# Altium schematic sheet besc mcu sch.SchDoc
size A4
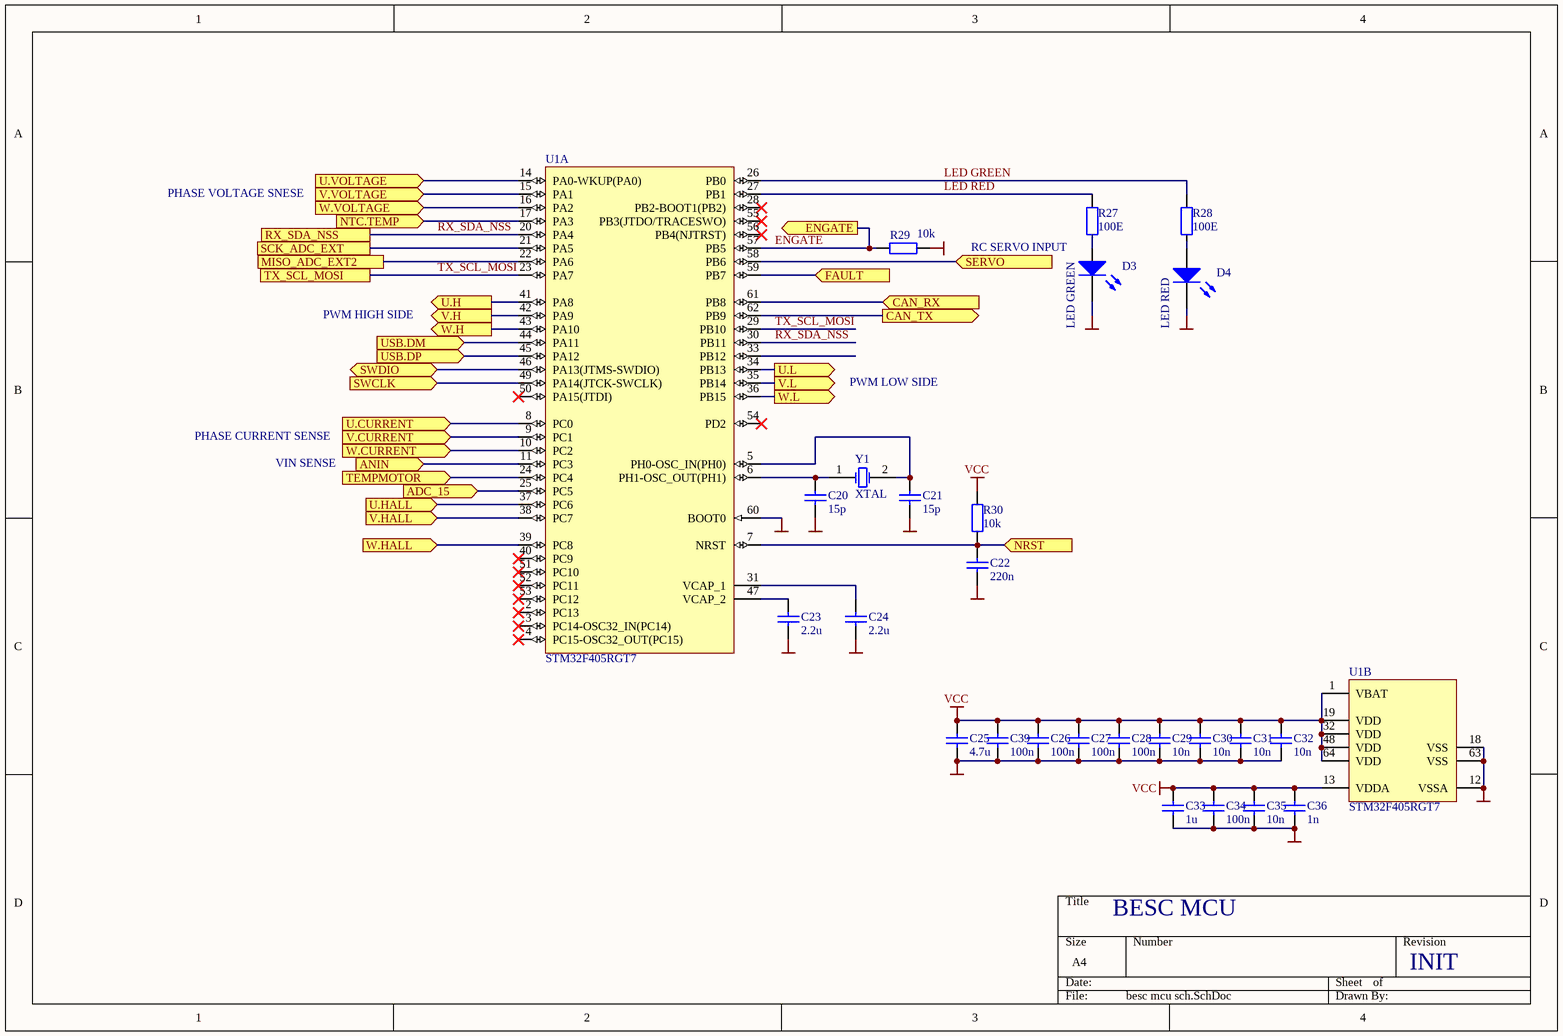
[diagram p0: besc mcu sch.SchDoc]

## Parts
C20  15p  [0603]
C21  15p  [0603]
C22  220n  [0603]
C23  2.2u  [0603]
C24  2.2u  [0603]
C25  4.7u  [0603]
C26  100n  [0603]
C27  100n  [0603]
C28  100n  [0603]
C29  10n  [0603]
C30  10n  [0603]
C31  10n  [0603]
C32  10n  [0603]
C33  1u  [0603]
C34  100n  [0603]
C35  10n  [0603]
C36  1n  [0603]
C39  100n  [0603]
D3  LED GREEN  [0805-diode]
D4  LED RED  [0805-diode]
R27  100E  [0603]
R28  100E  [0603]
R29  10k  [0603]
R30  10k  [0603]
U1  STM32F405RGT7  [STM-LQFP64_N]  (parts A,B of 2)
Y1  XTAL  [XTAL 5 x 3.2 mm]

## Ports
ADC_15 (in), ANIN (in), CAN_RX (in), CAN_TX (out), ENGATE (out), FAULT (in), MISO_ADC_EXT2, NRST (in), NTC.TEMP (in), RX_SDA_NSS, SCK_ADC_EXT, SERVO (in), SWCLK (in), SWDIO (bidir), TEMPMOTOR (in), TX_SCL_MOSI, U.CURRENT (in), U.H (out), U.HALL (in), U.L (out), U.VOLTAGE (in), USB.DM (in), USB.DP (in), V.CURRENT (in), V.H (out), V.HALL (in), V.L (out), V.VOLTAGE (in), W.CURRENT (in), W.H (out), W.HALL (in), W.L (out), W.VOLTAGE (in)

## Nets
LGND: C20.1 C21.1 C22.1 C23.1 C24.1 C25.1 C26.1 C27.1 C28.1 C29.1 C30.1 C31.1 C32.1 C33.1 C34.1 C35.1 C36.1 C39.1 D3.2(K) D4.2(K) R29.2 U1.12(VSSA) U1.18(VSS) U1.60(BOOT0) U1.63(VSS)
VCC: C25.2 C26.2 C27.2 C28.2 C29.2 C30.2 C31.2 C32.2 C33.2 C34.2 C35.2 C36.2 C39.2 R30.1 U1.1(VBAT) U1.13(VDDA) U1.19(VDD) U1.32(VDD) U1.48(VDD) U1.64(VDD)
ADC_15: U1.25(PC5) ; port ADC_15
ANIN: U1.11(PC3) ; port ANIN
CAN_RX: U1.61(PB8) ; port CAN_RX
CAN_TX: U1.62(PB9) ; port CAN_TX
ENGATE: R29.1 U1.57(PB5) ; port ENGATE
FAULT: U1.59(PB7) ; port FAULT
LED GREEN: R28.1 U1.26(PB0)
LED RED: R27.1 U1.27(PB1)
MISO_ADC_EXT2: U1.22(PA6) ; port MISO_ADC_EXT2
NRST: C22.2 R30.2 U1.7(NRST) ; port NRST
NTC.TEMP: U1.17(PA3) ; port NTC.TEMP
RX_SDA_NSS: U1.20(PA4) U1.30(PB11) ; port RX_SDA_NSS
SCK_ADC_EXT: U1.21(PA5) ; port SCK_ADC_EXT
SERVO: U1.58(PB6) ; port SERVO
SWCLK: U1.49(PA14(JTCK-SWCLK)) ; port SWCLK
SWDIO: U1.46(PA13(JTMS-SWDIO)) ; port SWDIO
TEMPMOTOR: U1.24(PC4) ; port TEMPMOTOR
TX_SCL_MOSI: U1.23(PA7) U1.29(PB10) ; port TX_SCL_MOSI
U.CURRENT: U1.8(PC0) ; port U.CURRENT
U.H: U1.41(PA8) ; port U.H
U.HALL: U1.37(PC6) ; port U.HALL
U.L: U1.34(PB13) ; port U.L
U.VOLTAGE: U1.14(PA0-WKUP(PA0)) ; port U.VOLTAGE
USB.DM: U1.44(PA11) ; port USB.DM
USB.DP: U1.45(PA12) ; port USB.DP
V.CURRENT: U1.9(PC1) ; port V.CURRENT
V.H: U1.42(PA9) ; port V.H
V.HALL: U1.38(PC7) ; port V.HALL
V.L: U1.35(PB14) ; port V.L
V.VOLTAGE: U1.15(PA1) ; port V.VOLTAGE
W.CURRENT: U1.10(PC2) ; port W.CURRENT
W.H: U1.43(PA10) ; port W.H
W.HALL: U1.39(PC8) ; port W.HALL
W.L: U1.36(PB15) ; port W.L
W.VOLTAGE: U1.16(PA2) ; port W.VOLTAGE
NetC20_2: C20.2 U1.6(PH1-OSC_OUT(PH1)) Y1.1(OSC1)
NetC21_2: C21.2 U1.5(PH0-OSC_IN(PH0)) Y1.2(OSC2)
NetC23_2: C23.2 U1.47(VCAP_2)
NetC24_2: C24.2 U1.31(VCAP_1)
NetD3_1: D3.1(A) R27.2
NetD4_1: D4.1(A) R28.2

Not connected (* = marked no-connect by the designer): U1 2(PC13)* 3(PC14-OSC32_IN(PC14))* 4(PC15-OSC32_OUT(PC15))* 28(PB2-BOOT1(PB2))* 33(PB12) 40(PC9)* 50(PA15(JTDI))* 51(PC10)* 52(PC11)* 53(PC12)* 54(PD2)* 55(PB3(JTDO/TRACESWO))* 56(PB4(NJTRST))*

## Notes on the sheet
- PHASE VOLTAGE SNESE
- RC SERVO INPUT
- PWM HIGH SIDE
- PWM LOW SIDE
- PHASE CURRENT SENSE
- VIN SENSE
- BESC MCU
- INIT

## Library data of the parts
C20-C36 C39 = cap: Capacitor; Published: 8-Jun-2000; LatestRevisionDate: 17-Jul-2002; LatestRevisionNote: Re-released for DXP Platform.; PackageReference: RAD-0.3; Publisher: Altium Limited; PackageDescription: Radial Cap, Thru-Hole; 2 Leads; 0.3 in Pin Spacing
D3 D4 = LED0: Typical INFRARED GaAs LED; Published: 8-Jun-2000; LatestRevisionDate: 08-Jul-2005; LatestRevisionNote: Mech Layer 1 removed.; PackageReference: LED-0; Publisher: Altium Limited; PackageDescription: LED; 2 Leads
R27-R30 = Res2: Resistor; Published: 8-Jun-2000; LatestRevisionDate: 17-Jul-2002; LatestRevisionNote: Re-released for DXP Platform.; PackageReference: AXIAL-0.4; Publisher: Altium Limited; PackageDescription: Axial Device, Thru-Hole; 2 Leads; 0.4 in Pin Spacing
U1 = STM32F405RGT7: ARM Cortex-M4 32-bit MCU+FPU, 210 DMIPS, 1024 kB Flash, 192 kB Internal RAM, 51 I/Os, 64-pin LQFP, -40 to 105 degC, Tray; Manufacturer: STMicroelectronics; D/A Converter: 2x12-bit; FLASH Size (Prog) (kB): 1024; I/Os (High Current): 51; Internal RAM Size (kB): 192; Operating Frequency(F) (Processor speed) (MHz): 168; Supply Voltage(Vcc) max (V): 3.6; Supply Voltage(Vcc) min (V): 1.8; DatasheetVersion: Rev. 4; PackageVersion: Rev. 4, 06/2013; PackageReference: LQFP64; PackageDescription: 64-Pin Low Profile Quad Flat Package, 10 x 10 mm Body, 0.5 mm Pitch; Supplier 1: Farnell; Supplier Part Number 1: 2333285; Supplier 2: Newark; Supplier Part Number 2: 99W9902; Supplier 3: Mouser; Supplier Part Number 3: N/A; Core: ARM Cortex-M4; Packing: Tray; Mounting Technology: Surface Mount; PartNumber: STM32F405RGT7; ComponentLink1Description: Manufacturer URL; ComponentLink1URL: http://www.st.com/web/en/home.html; ComponentLink2Description: Datasheet; ComponentLink2URL: http://www.st.com/st-web-ui/static/active/en/resource/technical/document/datasheet/DM00037051.pdf; ComponentLink3Description: Package Specification; ComponentLink3URL: http://www.st.com/st-web-ui/static/active/en/resource/technical/document/datasheet/DM00037051.pdf
Y1 = XTAL: Crystal Oscillator; Published: 8-Jun-2000; LatestRevisionDate: 17-Jul-2002; LatestRevisionNote: Re-released for DXP Platform.; PackageReference: R38; Publisher: Altium Limited; PackageDescription: Crystal, Thru-Hole; 2 Leads; Body 3.1 x 8.2 mm (Dia.xH)